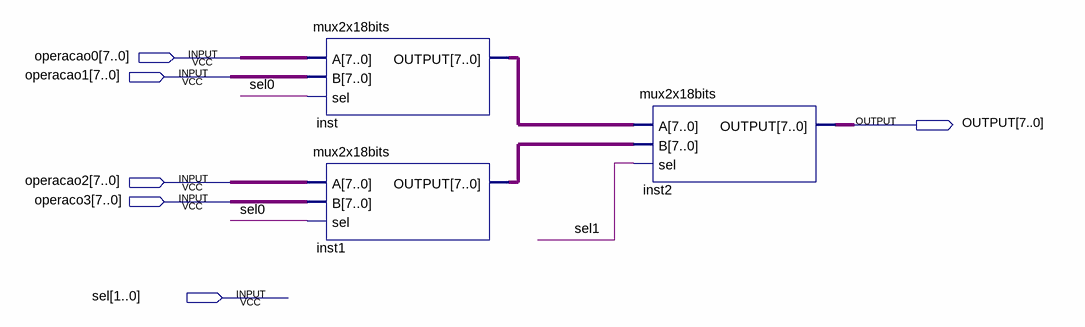
[diagram p0: schematic sheet]
// Quartus schematic mux4x18bits.bdf as structural Verilog: 3 symbols, 6 pins
module mux4x18bits (
  input  [7:0] operacao0,
  input  [7:0] operacao1,
  input  [7:0] operacao2,
  input  [7:0] operaco3,
  input  [1:0] sel,
  output [7:0] OUTPUT
);

  wire [7:0] inst1_output, inst_output;

  mux2x18bits inst (.A(operacao0), .B(operacao1), .sel(sel[0]), .OUTPUT(inst_output));
  mux2x18bits inst1 (.A(operacao2), .B(operaco3), .sel(sel[0]), .OUTPUT(inst1_output));
  mux2x18bits inst2 (.A(inst_output), .B(inst1_output), .sel(sel[1]), .OUTPUT(OUTPUT));
endmodule
